# EAGLE schematic HD210_MLL-Range-Extender_v006-X (EAGLE 9.6.2)
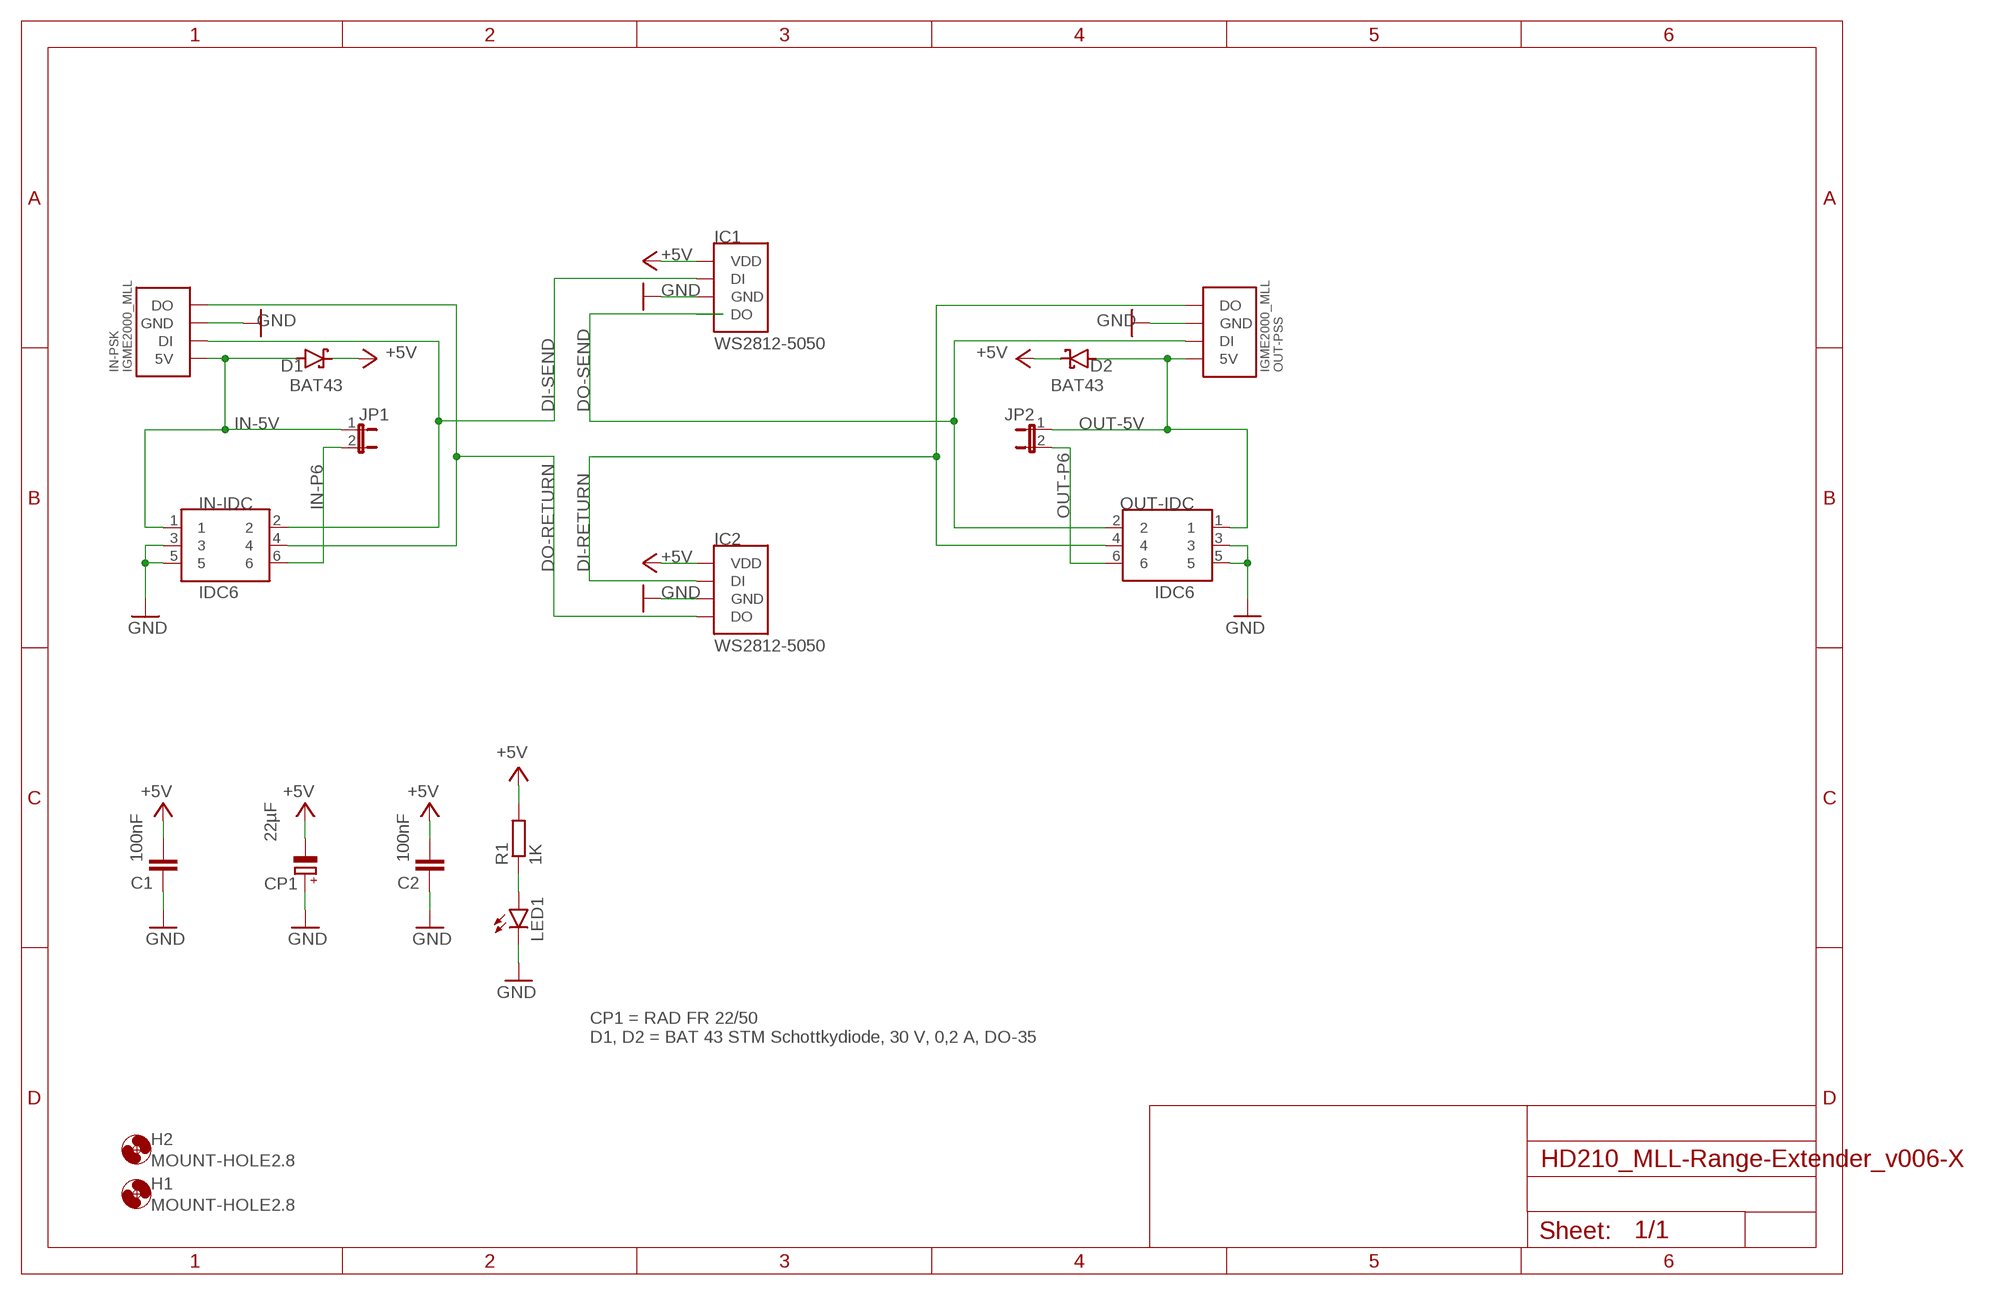
[diagram p0: schematic, sheet 1]

## Parts
C1  100nF  C-EU025-025X050  [C025-025X050]
C2  100nF  C-EU025-025X050  [C025-025X050]
CP1  22µF  CPOL-EUE2-5  [E2-5]
D1  BAT43  BAT42  [DO35-10]
D2  BAT43  BAT42  [DO35-10]
H1  MOUNT-HOLE2.8  [2,8]
H2  MOUNT-HOLE2.8  [2,8]
IC1  WS2812-5050  [5050]
IC2  WS2812-5050  [5050]
IN-IDC  IDC6  [IDC6]
IN-PSK  IGME2000_MLL  [PSSW4-SHORT]
JP1  JP1E  [JP1]
JP2  JP1E  [JP1]
LED1  LED3MM  [LED3MM]
OUT-IDC  IDC6  [IDC6]
OUT-PSS  IGME2000_MLL  [PSSW4-SHORT]
R1  1K  R-EU_0207/10  [0207/10]

## Nets
+5V: C1.2 C2.2 CP1.- D1.C D2.C IC1.VCC(VDD) IC2.VCC(VDD) R1.2
DI-RETURN: IC2.DI OUT-IDC.4 OUT-PSS.P$1(DO)
DI-SEND: IC1.DI IN-IDC.2 IN-PSK.P$2(DI)
DO-RETURN: IC2.DO IN-IDC.4 IN-PSK.P$1(DO)
DO-SEND: IC1.DO OUT-IDC.2 OUT-PSS.P$2(DI)
GND: C1.1 C2.1 CP1.+ IC1.GND IC2.GND IN-IDC.3 IN-IDC.5 IN-PSK.P$4(GND) LED1.K(C) OUT-IDC.3 OUT-IDC.5 OUT-PSS.P$4(GND)
IN-5V: D1.A IN-IDC.1 IN-PSK.P$3(5V) JP1.1
IN-P6: IN-IDC.6 JP1.2
N$1: LED1.A R1.1
OUT-5V: D2.A JP2.1 OUT-IDC.1 OUT-PSS.P$3(5V)
OUT-P6: JP2.2 OUT-IDC.6

## Notes on the sheet
- CP1 = RAD FR 22/50
  D1, D2 = BAT 43 STM Schottkydiode, 30 V, 0,2 A, DO-35

## Library data of the parts
C1 C2 = rcl:C-EU: CAPACITOR, European symbol; SPICEPREFIX: C
CP1 = rcl:CPOL-EU: POLARIZED CAPACITOR, European symbol; SPICEPREFIX: C
D1 D2 = diode:BAT42: DIODE barrier diode
H1 H2 = holes:MOUNT-HOLE: MOUNTING HOLE with drill center marker
IC1 IC2 = MLL-Dominik-Hardi:WS2812-
IN-IDC OUT-IDC = MLL-Dominik-Hardi:IDC6
IN-PSK OUT-PSS = HD_Kontakte:IGME2000_MLL
JP1 JP2 = jumper:JP1E: JUMPER
LED1 = led:LED: LED OSRAM: - CHIPLED LG R971, LG N971, LY N971, LG Q971, LY Q971, LO R971, LY R971 LH N974, LH R974 LS Q976, LO Q976, LY Q976 LO Q996 - Hyper CHIPLED LW Q18S LB Q993, LB Q99A, LB R99A - SideLED LS A670, LO A670, LY A670, LG A670, LP A670 LB A673, LV A673, LT A673, LW A673 LH A674 LY A675 LS A676, LA A676, LO A676, LY A676, LW A676 LS A679, LY A679, LG A679 - Hyper Micro SIDELED® LS Y876, LA Y876, LO Y876, LY Y876 LT Y87S - SmartLED LW L88C, LW L88S LB L89C, LB L89S, LG L890 LS L89K, LO L89K, LY L89K LS L896, LA L896, LO L896, LY L896 - TOPLED LS T670, LO T670, LY T670, LG T670, LP T670 LSG T670, LSP T670, LSY T670, LOP T670, LYG T670 LG T671, LOG T671, LSG T671 LB T673, LV T673, LT T673, LW T673 LH T674 LS T676, LA T676, LO T676, LY T676, LB T676, LH T676, LSB T676, LW T676 LB T67C, LV T67C, LT T67C, LS T67K, LO T67K, LY T67K, LW E67C LS E67B, LA E67B, LO E67B, LY E67B, LB E67C, LV E67C, LT E67C LW T67C LS T679, LY T679, LG T679 LS T770, LO T770, LY T770, LG T770, LP T770 LB T773, LV T773, LT T773, LW T773 LH T774 LS E675, LA E675, LY E675, LS T675 LS T776, LA T776, LO T776, LY T776, LB T776 LHGB T686 LT T68C, LB T68C - Hyper Mini TOPLED® LB M676 - Mini TOPLED Santana® LG M470 LS M47K, LO M47K, LY M47K Source: http://www.osram.convergy.de LUXEON: - LUMILED® LXK2-PW12-R00, LXK2-PW12-S00, LXK2-PW14-U00, LXK2-PW14-V00 LXK2-PM12-R00, LXK2-PM12-S00, LXK2-PM14-U00 LXK2-PE12-Q00, LXK2-PE12-R00, LXK2-PE12-S00, LXK2-PE14-T00, LXK2-PE14-U00 LXK2-PB12-K00, LXK2-PB12-L00, LXK2-PB12-M00, LXK2-PB14-N00, LXK2-PB14-P00, LXK2-PB14-Q00 LXK2-PR12-L00, LXK2-PR12-M00, LXK2-PR14-Q00, LXK2-PR14-R00 LXK2-PD12-Q00, LXK2-PD12-R00, LXK2-PD12-S00 LXK2-PH12-R00, LXK2-PH12-S00 LXK2-PL12-P00, LXK2-PL12-Q00, LXK2-PL12-R00 Source: www.luxeon.com KINGBRIGHT: KA-3528ASYC Source: www.kingbright.com
R1 = rcl:R-EU_: RESISTOR, European symbol; SPICEPREFIX: R